# Altium schematic sheet Battery.SchDoc
size 209 x 297 mm; Author: Мурашкин Д.В.; Address1: Address1; Address2: Address2; Address3: Address3; Address4: Address4; DocumentNumber: SS19946-01; Scale: 1:1; Letter1Column: Э; PartName: Блок питания
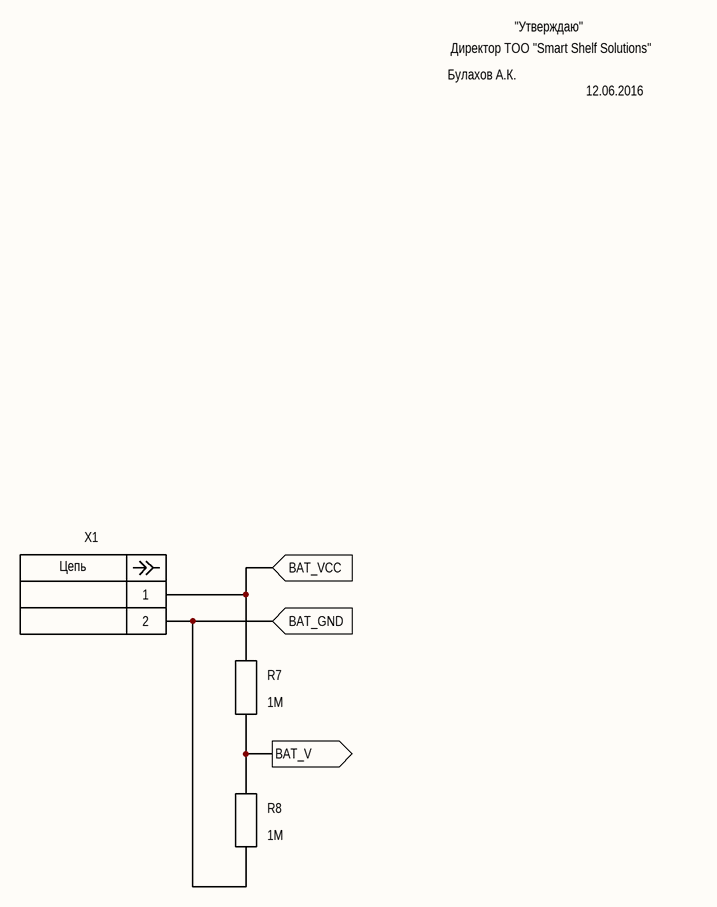
[diagram p0: Battery.SchDoc]

## Parts
R7  1M  [RESC1608L]
R8  1M  [RESC1608L]
X1  B2B-XH-A  [B2B-XH-A]  (value not drawn)

## Ports
BAT_GND, BAT_V (out), BAT_VCC

## Nets
BAT_GND: R8.2 X1.2 ; port BAT_GND
BAT_V: R7.2 R8.1 ; port BAT_V
BAT_VCC: R7.1 X1.1 ; port BAT_VCC

## Notes on the sheet
- Булахов А.К.
- "Утверждаю"
- Директор ТОО "Smart Shelf Solutions"
- 12.06.2016
- Перв. примен.
- Справ. №
- Подп. и дата
- Инв. № дубл.
- Взам. инв. №
- Разраб.
- Изм.
- Лист
- № докум.
- Подп.
- Дата
- Лит.
- Масса
- Масштаб
- Пров.
- Т.контр.
- Листов
- Инв. № подл.
- Утв.
- Н.контр.
- 2.106-A4
- Копировал
- Формат А4
- (in symbol B2B-XH-A) Цепь

## Library data of the parts
R7 R8 = RC0603JR-071ML: Resistor Ceramic 1M 1608; Manufacturer: Yageo; Group: Resistors; Temperature Coefficient: ±100ppm/°C; Tolerance: ±5%; Power: 0.1W; Short description: RES SMD 1M OHM 5% 1/10W 0603; Part name: RC0603JR-071ML; Type: Thin Film; Package: 1608; Value: 1M
X1 = B2B-XH-A: Header, 2.54, 2p, Top; Manufacturer: JST Sales America Inc; Part name: B2B-XH-A(LF)(SN); Group: Rectangular Connectors - Headers, Male Pins; Short description: CONN HEADER XH TOP 2POS 2.5MM; Package: 2 DIP 2.54; Distributor: Digi-Key